# EAGLE design Flipdot_control (EAGLE 8.2.1)
Flip-dot Segment Controller

## Sheet 1 of 4: Connector and Row Drivers
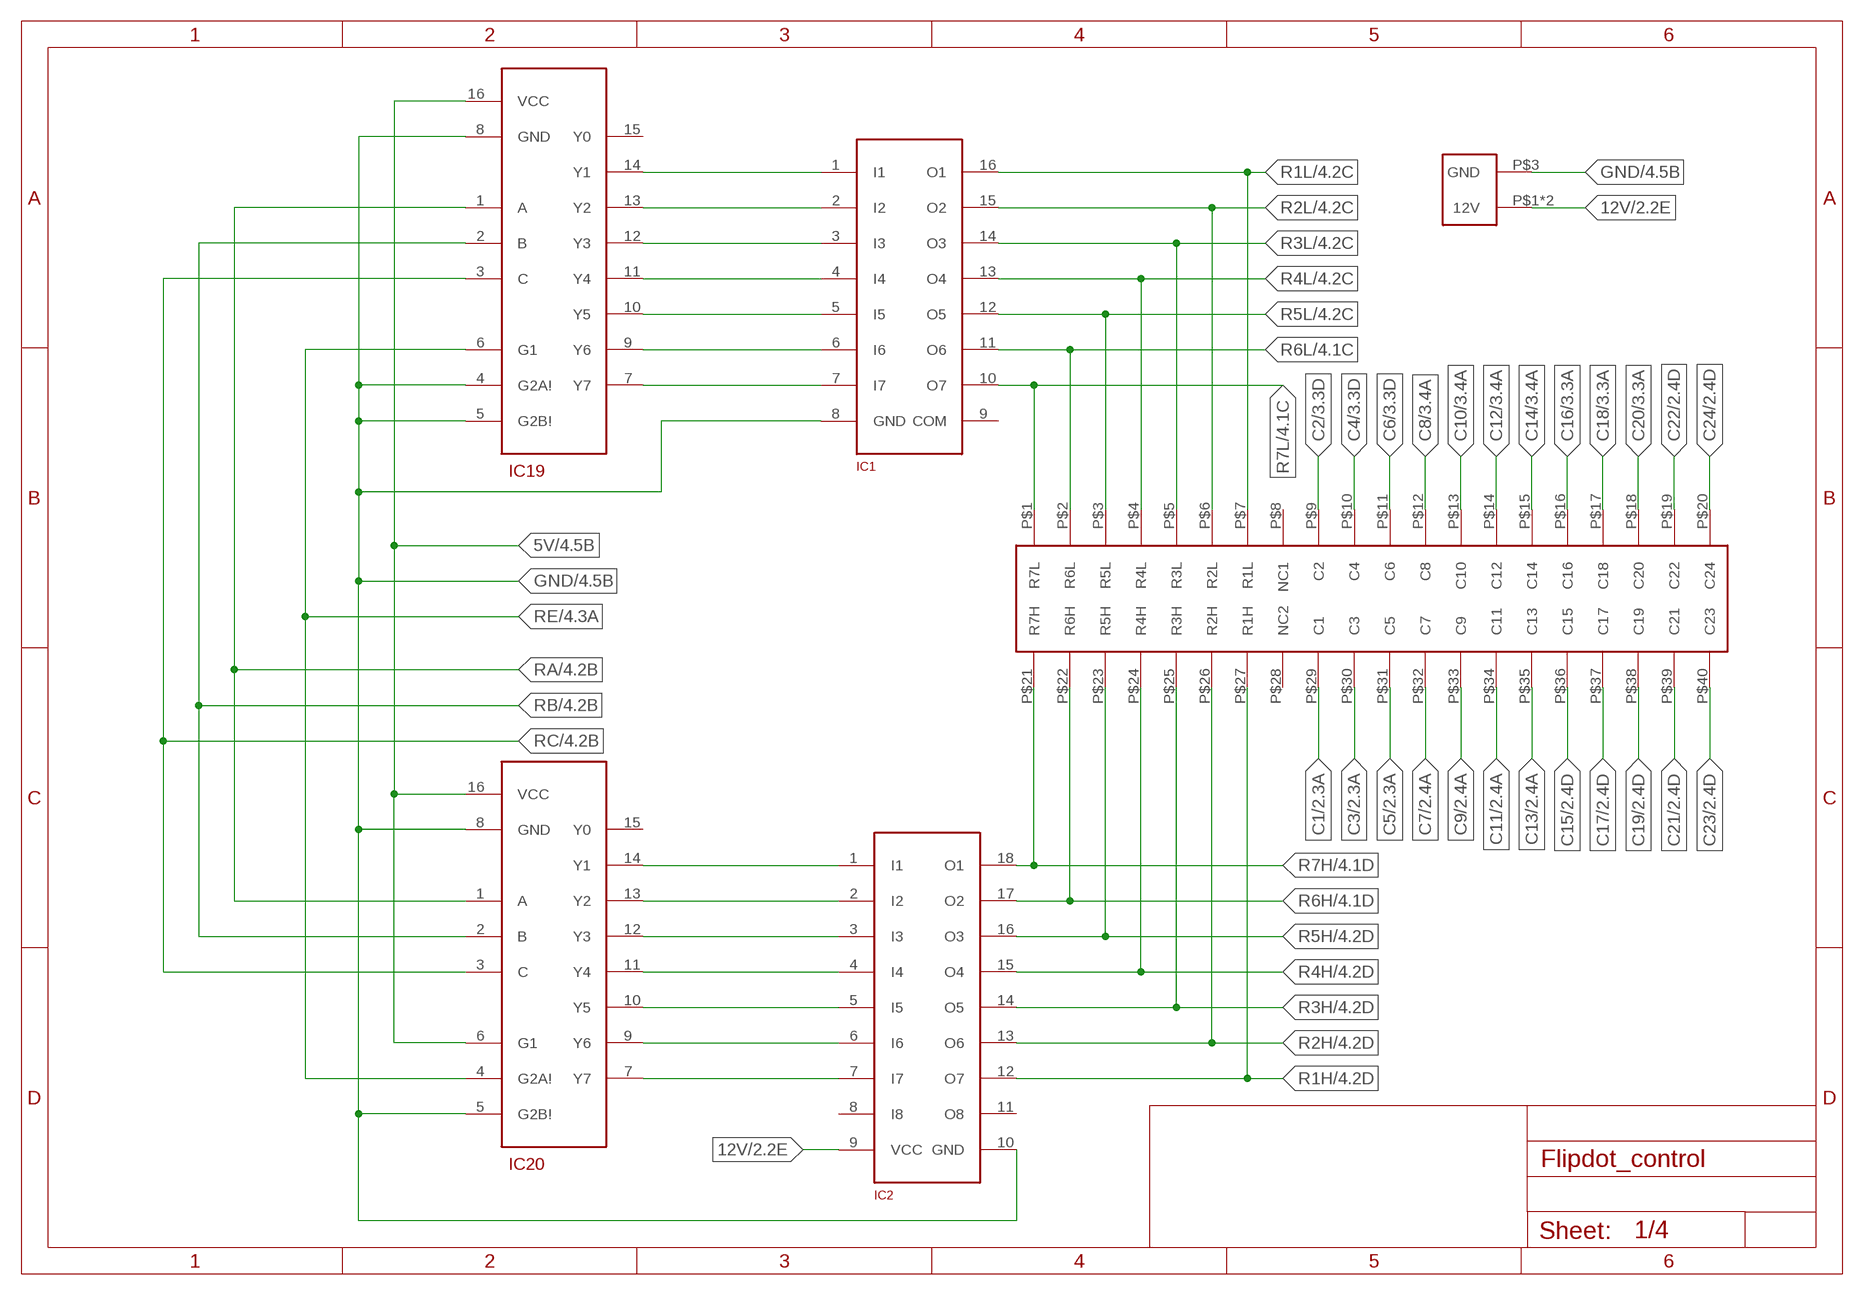
[diagram p0: schematic, sheet 1]

### Parts
IC1  ULN2003  [SO16]
IC2  TD62783_AFWG  [SO18W]
IC19  M74HC238  [SO16]
IC20  M74HC238  [SO16]
J1  HEADER_40  [HEADER_40]
U$1  PS  [PS]

### Nets
5V: IC19.16(VCC) IC20.6(G1) IC20.16(VCC) ; also sheet 2,3,4
12V: IC2.9(VCC) U$1.P$1(12V) U$1.P$2(12V) ; also sheet 2,3,4
C1: J1.P$29(C1) ; also sheet 2
C2: J1.P$9(C2) ; also sheet 3
C3: J1.P$30(C3) ; also sheet 2
C4: J1.P$10(C4) ; also sheet 3
C5: J1.P$31(C5) ; also sheet 2
C6: J1.P$11(C6) ; also sheet 3
C7: J1.P$32(C7) ; also sheet 2
C8: J1.P$12(C8) ; also sheet 3
C9: J1.P$33(C9) ; also sheet 2
C10: J1.P$13(C10) ; also sheet 3
C11: J1.P$34(C11) ; also sheet 2
C12: J1.P$14(C12) ; also sheet 3
C13: J1.P$35(C13) ; also sheet 2
C14: J1.P$15(C14) ; also sheet 3
C15: J1.P$36(C15) ; also sheet 2
C16: J1.P$16(C16) ; also sheet 3
C17: J1.P$37(C17) ; also sheet 2
C18: J1.P$17(C18) ; also sheet 3
C19: J1.P$38(C19) ; also sheet 2
C20: J1.P$18(C20) ; also sheet 3
C21: J1.P$39(C21) ; also sheet 2
C22: J1.P$19(C22) ; also sheet 2
C23: J1.P$40(C23) ; also sheet 2
C24: J1.P$20(C24) ; also sheet 2
GND: IC1.8(GND) IC2.10(GND) IC19.4(G2A!) IC19.5(G2B!) IC19.8(GND) IC20.5(G2B!) IC20.8(GND) U$1.P$3(GND) ; also sheet 2,3,4
N$15: IC1.1(I1) IC19.14(Y1)
N$16: IC1.2(I2) IC19.13(Y2)
N$17: IC1.3(I3) IC19.12(Y3)
N$18: IC1.4(I4) IC19.11(Y4)
N$19: IC1.5(I5) IC19.10(Y5)
N$20: IC1.6(I6) IC19.9(Y6)
N$21: IC1.7(I7) IC19.7(Y7)
N$24: IC2.1(I1) IC20.14(Y1)
N$25: IC2.2(I2) IC20.13(Y2)
N$26: IC2.3(I3) IC20.12(Y3)
N$27: IC2.4(I4) IC20.11(Y4)
N$28: IC2.5(I5) IC20.10(Y5)
N$29: IC2.6(I6) IC20.9(Y6)
N$30: IC2.7(I7) IC20.7(Y7)
R1H: IC2.12(O7) J1.P$27(R1H) ; also sheet 4
R1L: IC1.16(O1) J1.P$7(R1L) ; also sheet 4
R2H: IC2.13(O6) J1.P$26(R2H) ; also sheet 4
R2L: IC1.15(O2) J1.P$6(R2L) ; also sheet 4
R3H: IC2.14(O5) J1.P$25(R3H) ; also sheet 4
R3L: IC1.14(O3) J1.P$5(R3L) ; also sheet 4
R4H: IC2.15(O4) J1.P$24(R4H) ; also sheet 4
R4L: IC1.13(O4) J1.P$4(R4L) ; also sheet 4
R5H: IC2.16(O3) J1.P$23(R5H) ; also sheet 4
R5L: IC1.12(O5) J1.P$3(R5L) ; also sheet 4
R6H: IC2.17(O2) J1.P$22(R6H) ; also sheet 4
R6L: IC1.11(O6) J1.P$2(R6L) ; also sheet 4
R7H: IC2.18(O1) J1.P$21(R7H) ; also sheet 4
R7L: IC1.10(O7) J1.P$1(R7L) ; also sheet 4
RA: IC19.1(A) IC20.1(A) ; also sheet 4
RB: IC19.2(B) IC20.2(B) ; also sheet 4
RC: IC19.3(C) IC20.3(C) ; also sheet 4
RE: IC19.6(G1) IC20.4(G2A!) ; also sheet 4
Unconnected: IC1.9(COM) IC2.8(I8) IC2.11(O8) IC19.15(Y0) IC20.15(Y0) J1.P$8(NC1) J1.P$28(NC2)

## Sheet 2 of 4: Demultiplexers 1-4
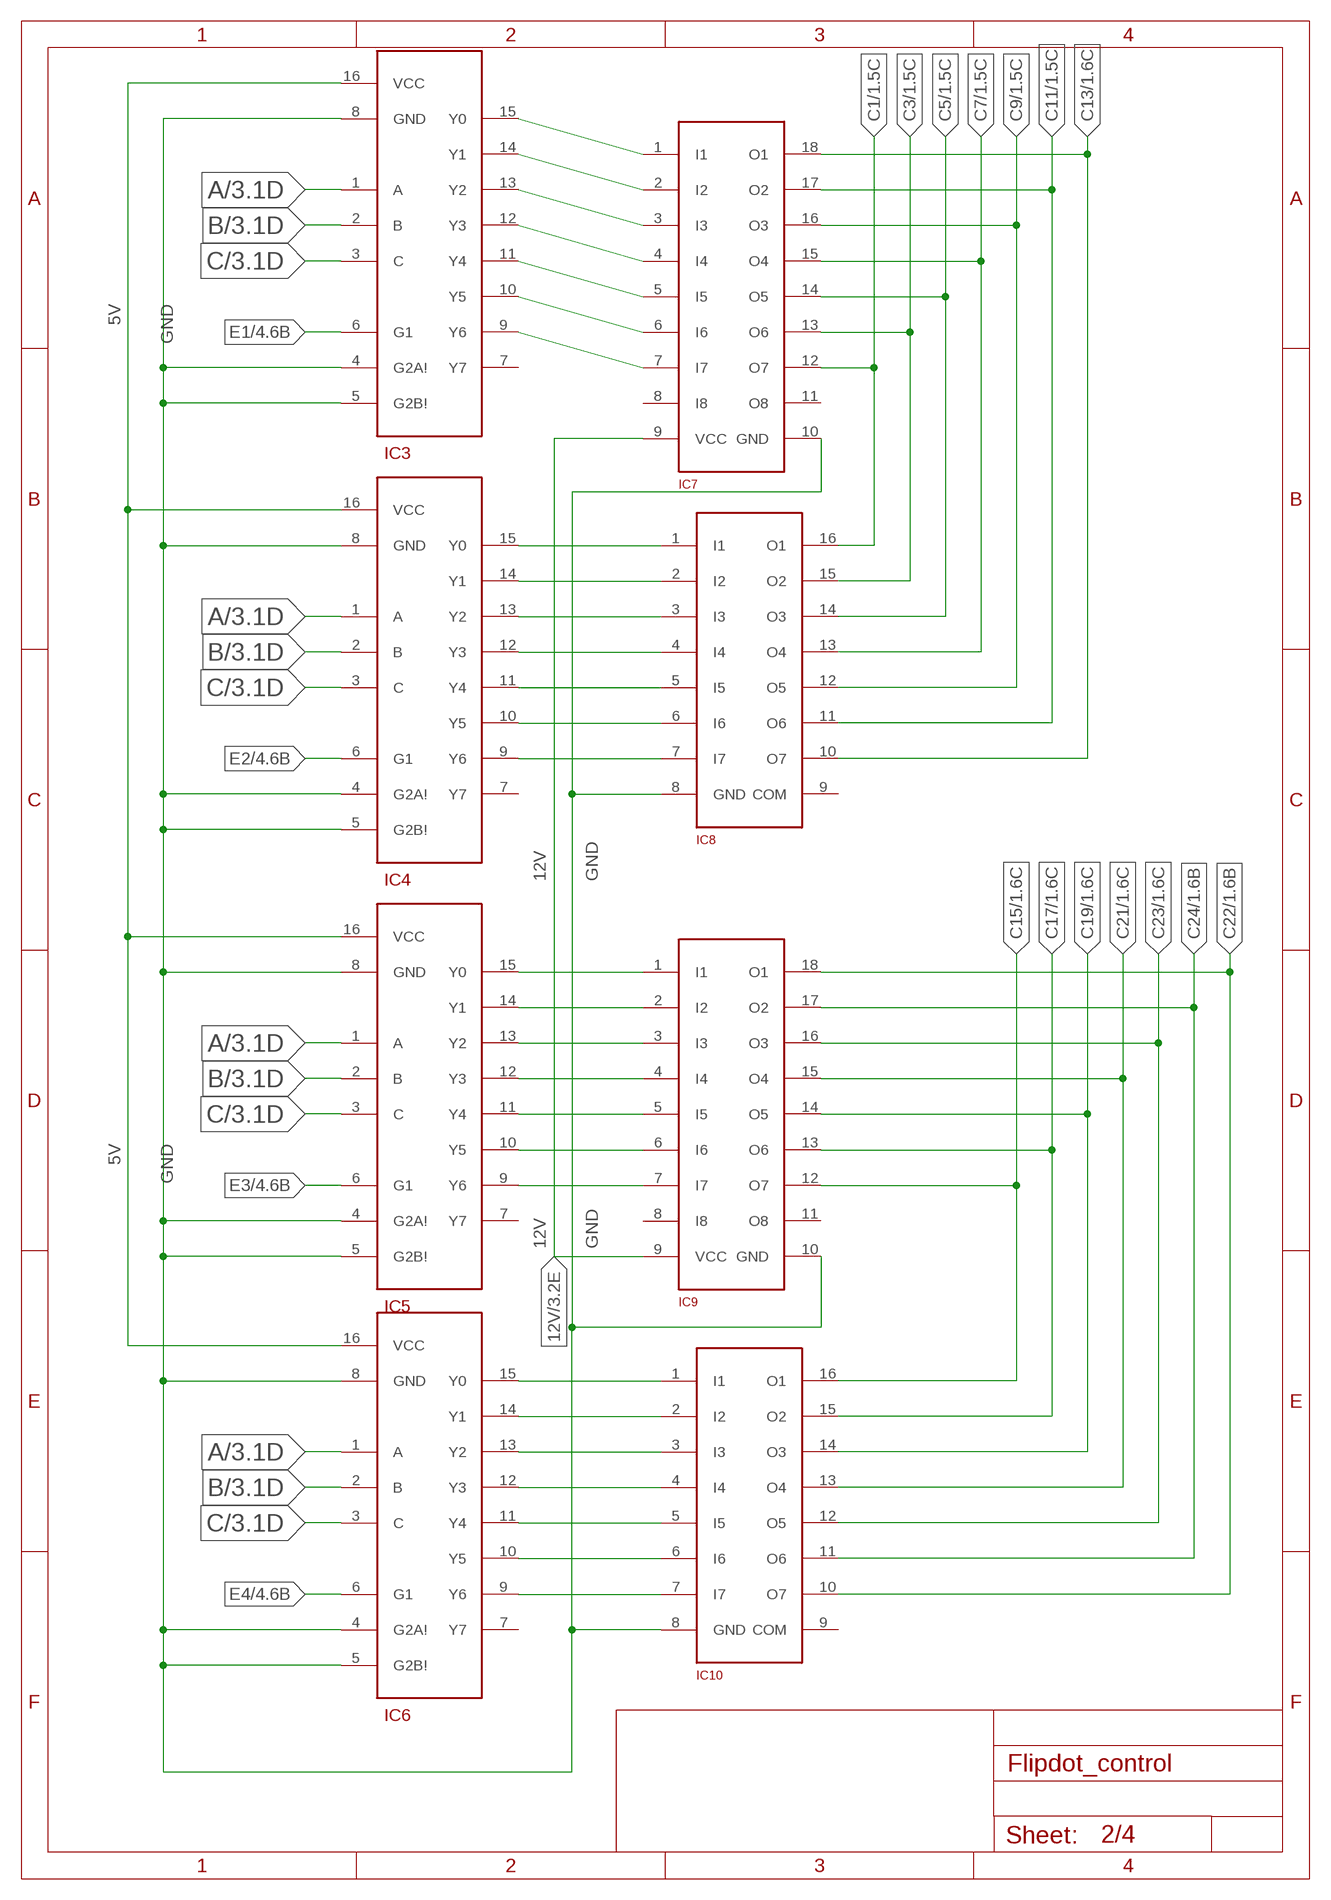
[diagram p1: schematic, sheet 2]

### Parts
IC3  M74HC238  [SO16]
IC4  M74HC238  [SO16]
IC5  M74HC238  [SO16]
IC6  M74HC238  [SO16]
IC7  TD62783_AFWG  [SO18W]
IC8  ULN2003  [SO16]
IC9  TD62783_AFWG  [SO18W]
IC10  ULN2003  [SO16]

### Nets
5V: IC3.16(VCC) IC4.16(VCC) IC5.16(VCC) IC6.16(VCC) ; also sheet 1,3,4
12V: IC7.9(VCC) IC9.9(VCC) ; also sheet 1,3,4
A: IC3.1(A) IC4.1(A) IC5.1(A) IC6.1(A) ; also sheet 3,4
B: IC3.2(B) IC4.2(B) IC5.2(B) IC6.2(B) ; also sheet 3,4
C: IC3.3(C) IC4.3(C) IC5.3(C) IC6.3(C) ; also sheet 3,4
C1: IC7.12(O7) IC8.16(O1) ; also sheet 1
C3: IC7.13(O6) IC8.15(O2) ; also sheet 1
C5: IC7.14(O5) IC8.14(O3) ; also sheet 1
C7: IC7.15(O4) IC8.13(O4) ; also sheet 1
C9: IC7.16(O3) IC8.12(O5) ; also sheet 1
C11: IC7.17(O2) IC8.11(O6) ; also sheet 1
C13: IC7.18(O1) IC8.10(O7) ; also sheet 1
C15: IC9.12(O7) IC10.16(O1) ; also sheet 1
C17: IC9.13(O6) IC10.15(O2) ; also sheet 1
C19: IC9.14(O5) IC10.14(O3) ; also sheet 1
C21: IC9.15(O4) IC10.13(O4) ; also sheet 1
C22: IC9.18(O1) IC10.10(O7) ; also sheet 1
C23: IC9.16(O3) IC10.12(O5) ; also sheet 1
C24: IC9.17(O2) IC10.11(O6) ; also sheet 1
E1: IC3.6(G1) ; also sheet 4
E2: IC4.6(G1) ; also sheet 4
E3: IC5.6(G1) ; also sheet 4
E4: IC6.6(G1) ; also sheet 4
GND: IC3.4(G2A!) IC3.5(G2B!) IC3.8(GND) IC4.4(G2A!) IC4.5(G2B!) IC4.8(GND) IC5.4(G2A!) IC5.5(G2B!) IC5.8(GND) IC6.4(G2A!) IC6.5(G2B!) IC6.8(GND) IC7.10(GND) IC8.8(GND) IC9.10(GND) IC10.8(GND) ; also sheet 1,3,4
N$83: IC3.15(Y0) IC7.1(I1)
N$84: IC3.14(Y1) IC7.2(I2)
N$85: IC3.13(Y2) IC7.3(I3)
N$86: IC3.12(Y3) IC7.4(I4)
N$87: IC3.11(Y4) IC7.5(I5)
N$88: IC3.10(Y5) IC7.6(I6)
N$89: IC3.9(Y6) IC7.7(I7)
N$90: IC4.15(Y0) IC8.1(I1)
N$91: IC4.14(Y1) IC8.2(I2)
N$92: IC4.13(Y2) IC8.3(I3)
N$93: IC4.12(Y3) IC8.4(I4)
N$94: IC4.11(Y4) IC8.5(I5)
N$95: IC4.10(Y5) IC8.6(I6)
N$96: IC4.9(Y6) IC8.7(I7)
N$97: IC5.15(Y0) IC9.1(I1)
N$98: IC5.14(Y1) IC9.2(I2)
N$99: IC5.13(Y2) IC9.3(I3)
N$100: IC5.12(Y3) IC9.4(I4)
N$101: IC5.11(Y4) IC9.5(I5)
N$102: IC5.10(Y5) IC9.6(I6)
N$103: IC5.9(Y6) IC9.7(I7)
N$104: IC6.15(Y0) IC10.1(I1)
N$105: IC6.14(Y1) IC10.2(I2)
N$106: IC6.13(Y2) IC10.3(I3)
N$107: IC6.12(Y3) IC10.4(I4)
N$108: IC6.11(Y4) IC10.5(I5)
N$109: IC6.10(Y5) IC10.6(I6)
N$110: IC6.9(Y6) IC10.7(I7)
Unconnected: IC3.7(Y7) IC4.7(Y7) IC5.7(Y7) IC6.7(Y7) IC7.8(I8) IC7.11(O8) IC8.9(COM) IC9.8(I8) IC9.11(O8) IC10.9(COM)

## Sheet 3 of 4: Demultiplexers 5-7
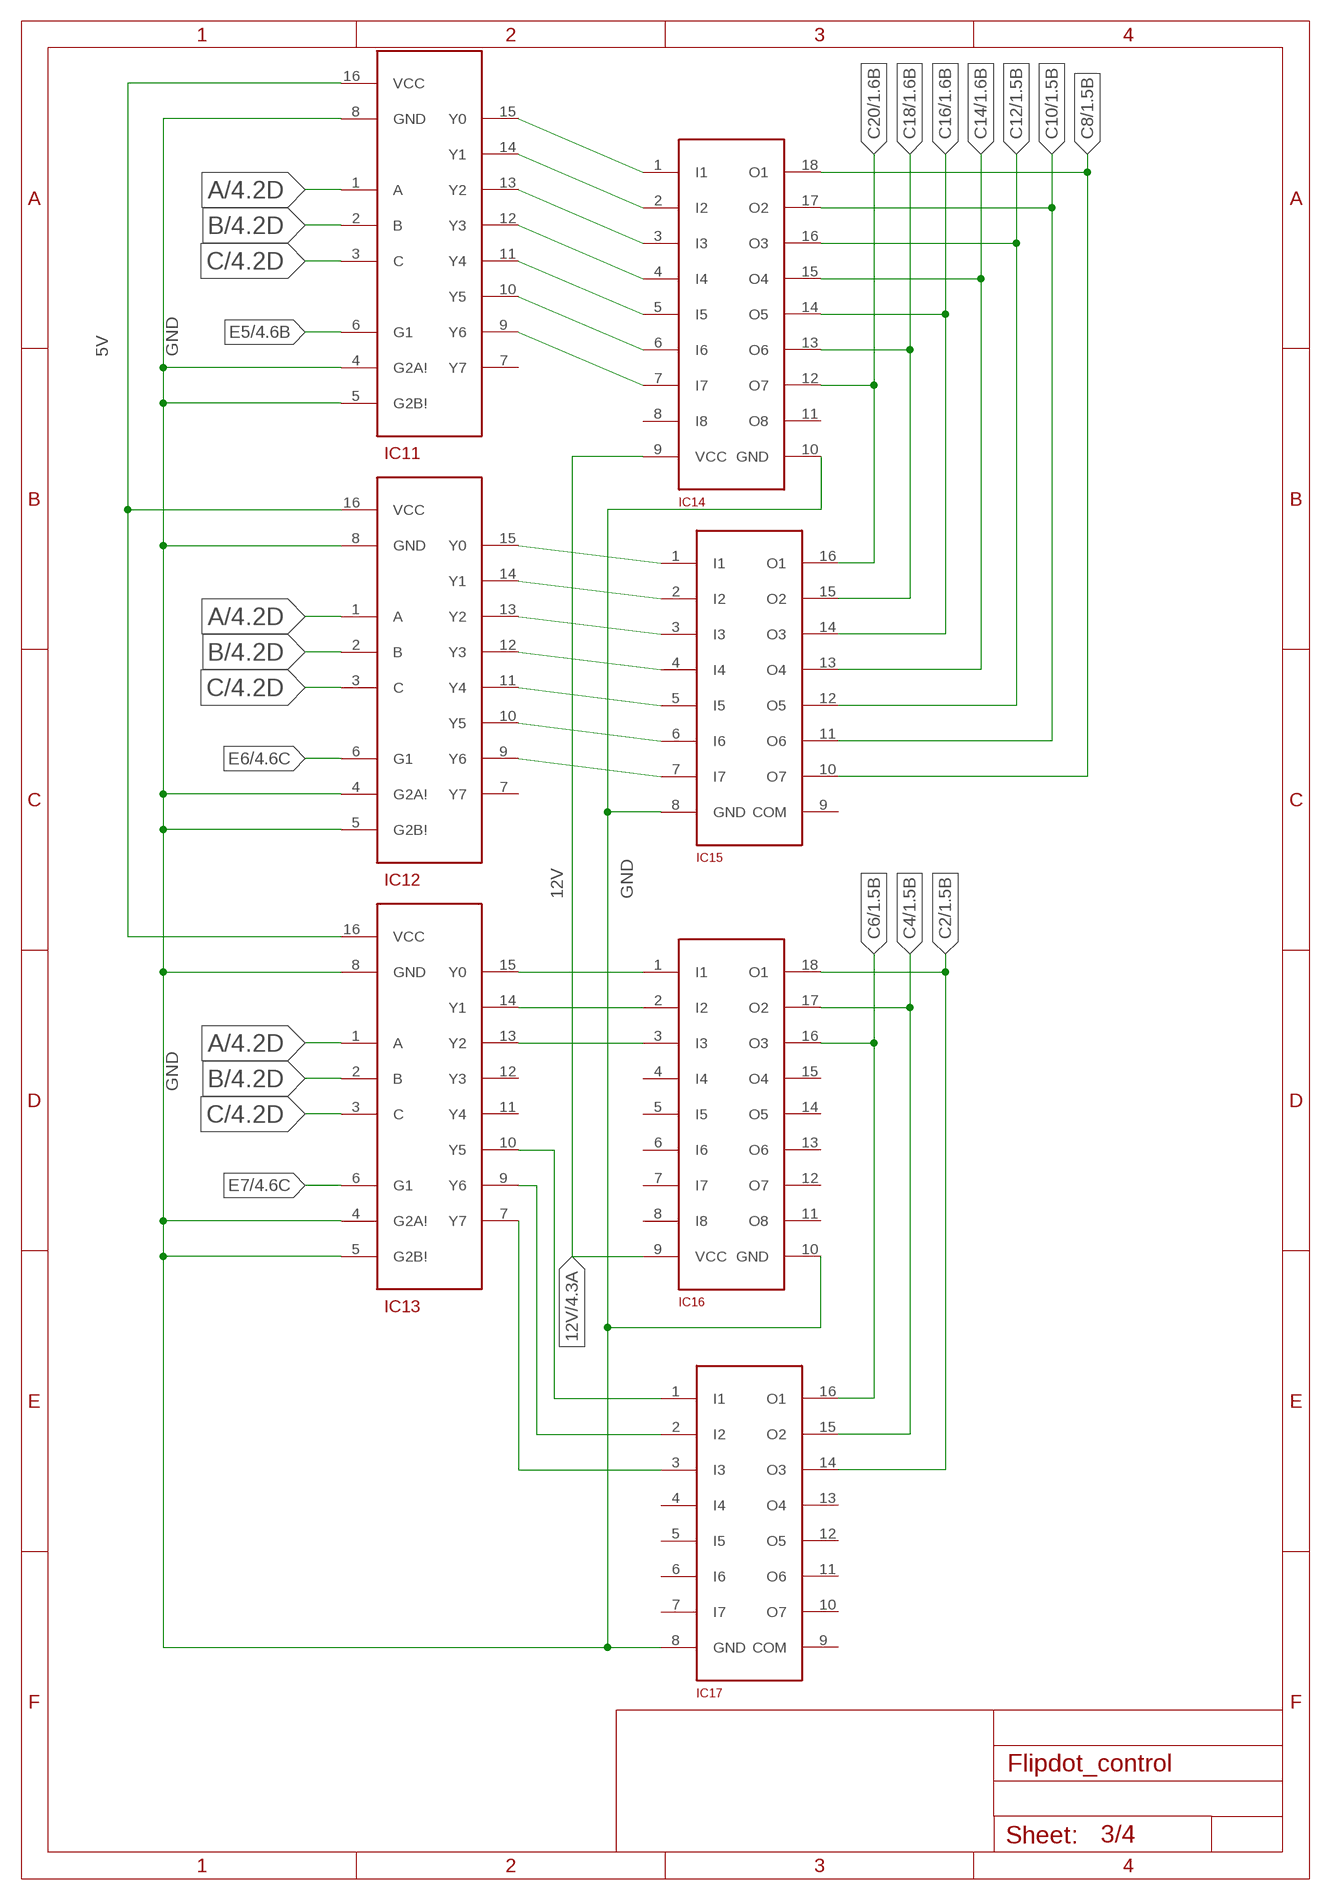
[diagram p2: schematic, sheet 3]

### Parts
IC11  M74HC238  [SO16]
IC12  M74HC238  [SO16]
IC13  M74HC238  [SO16]
IC14  TD62783_AFWG  [SO18W]
IC15  ULN2003  [SO16]
IC16  TD62783_AFWG  [SO18W]
IC17  ULN2003  [SO16]

### Nets
5V: IC11.16(VCC) IC12.16(VCC) IC13.16(VCC) ; also sheet 1,2,4
12V: IC14.9(VCC) IC16.9(VCC) ; also sheet 1,2,4
A: IC11.1(A) IC12.1(A) IC13.1(A) ; also sheet 2,4
B: IC11.2(B) IC12.2(B) IC13.2(B) ; also sheet 2,4
C: IC11.3(C) IC12.3(C) IC13.3(C) ; also sheet 2,4
C2: IC16.18(O1) IC17.14(O3) ; also sheet 1
C4: IC16.17(O2) IC17.15(O2) ; also sheet 1
C6: IC16.16(O3) IC17.16(O1) ; also sheet 1
C8: IC14.18(O1) IC15.10(O7) ; also sheet 1
C10: IC14.17(O2) IC15.11(O6) ; also sheet 1
C12: IC14.16(O3) IC15.12(O5) ; also sheet 1
C14: IC14.15(O4) IC15.13(O4) ; also sheet 1
C16: IC14.14(O5) IC15.14(O3) ; also sheet 1
C18: IC14.13(O6) IC15.15(O2) ; also sheet 1
C20: IC14.12(O7) IC15.16(O1) ; also sheet 1
E5: IC11.6(G1) ; also sheet 4
E6: IC12.6(G1) ; also sheet 4
E7: IC13.6(G1) ; also sheet 4
GND: IC11.4(G2A!) IC11.5(G2B!) IC11.8(GND) IC12.4(G2A!) IC12.5(G2B!) IC12.8(GND) IC13.4(G2A!) IC13.5(G2B!) IC13.8(GND) IC14.10(GND) IC15.8(GND) IC16.10(GND) IC17.8(GND) ; also sheet 1,2,4
N$63: IC11.15(Y0) IC14.1(I1)
N$64: IC11.14(Y1) IC14.2(I2)
N$65: IC11.13(Y2) IC14.3(I3)
N$66: IC11.12(Y3) IC14.4(I4)
N$67: IC11.11(Y4) IC14.5(I5)
N$68: IC11.10(Y5) IC14.6(I6)
N$69: IC11.9(Y6) IC14.7(I7)
N$70: IC12.15(Y0) IC15.1(I1)
N$71: IC12.14(Y1) IC15.2(I2)
N$72: IC12.13(Y2) IC15.3(I3)
N$73: IC12.12(Y3) IC15.4(I4)
N$74: IC12.11(Y4) IC15.5(I5)
N$75: IC12.10(Y5) IC15.6(I6)
N$76: IC12.9(Y6) IC15.7(I7)
N$77: IC13.15(Y0) IC16.1(I1)
N$78: IC13.14(Y1) IC16.2(I2)
N$79: IC13.13(Y2) IC16.3(I3)
N$80: IC13.10(Y5) IC17.1(I1)
N$81: IC13.9(Y6) IC17.2(I2)
N$82: IC13.7(Y7) IC17.3(I3)
Unconnected: IC11.7(Y7) IC12.7(Y7) IC13.11(Y4) IC13.12(Y3) IC14.8(I8) IC14.11(O8) IC15.9(COM) IC16.4(I4) IC16.5(I5) IC16.6(I6) IC16.7(I7) IC16.8(I8) IC16.11(O8) IC16.12(O7) IC16.13(O6) IC16.14(O5) IC16.15(O4) IC17.4(I4) IC17.5(I5) IC17.6(I6) IC17.7(I7) IC17.9(COM) IC17.10(O7) IC17.11(O6) IC17.12(O5) IC17.13(O4)

## Sheet 4 of 4: Pre-Demultiplexer
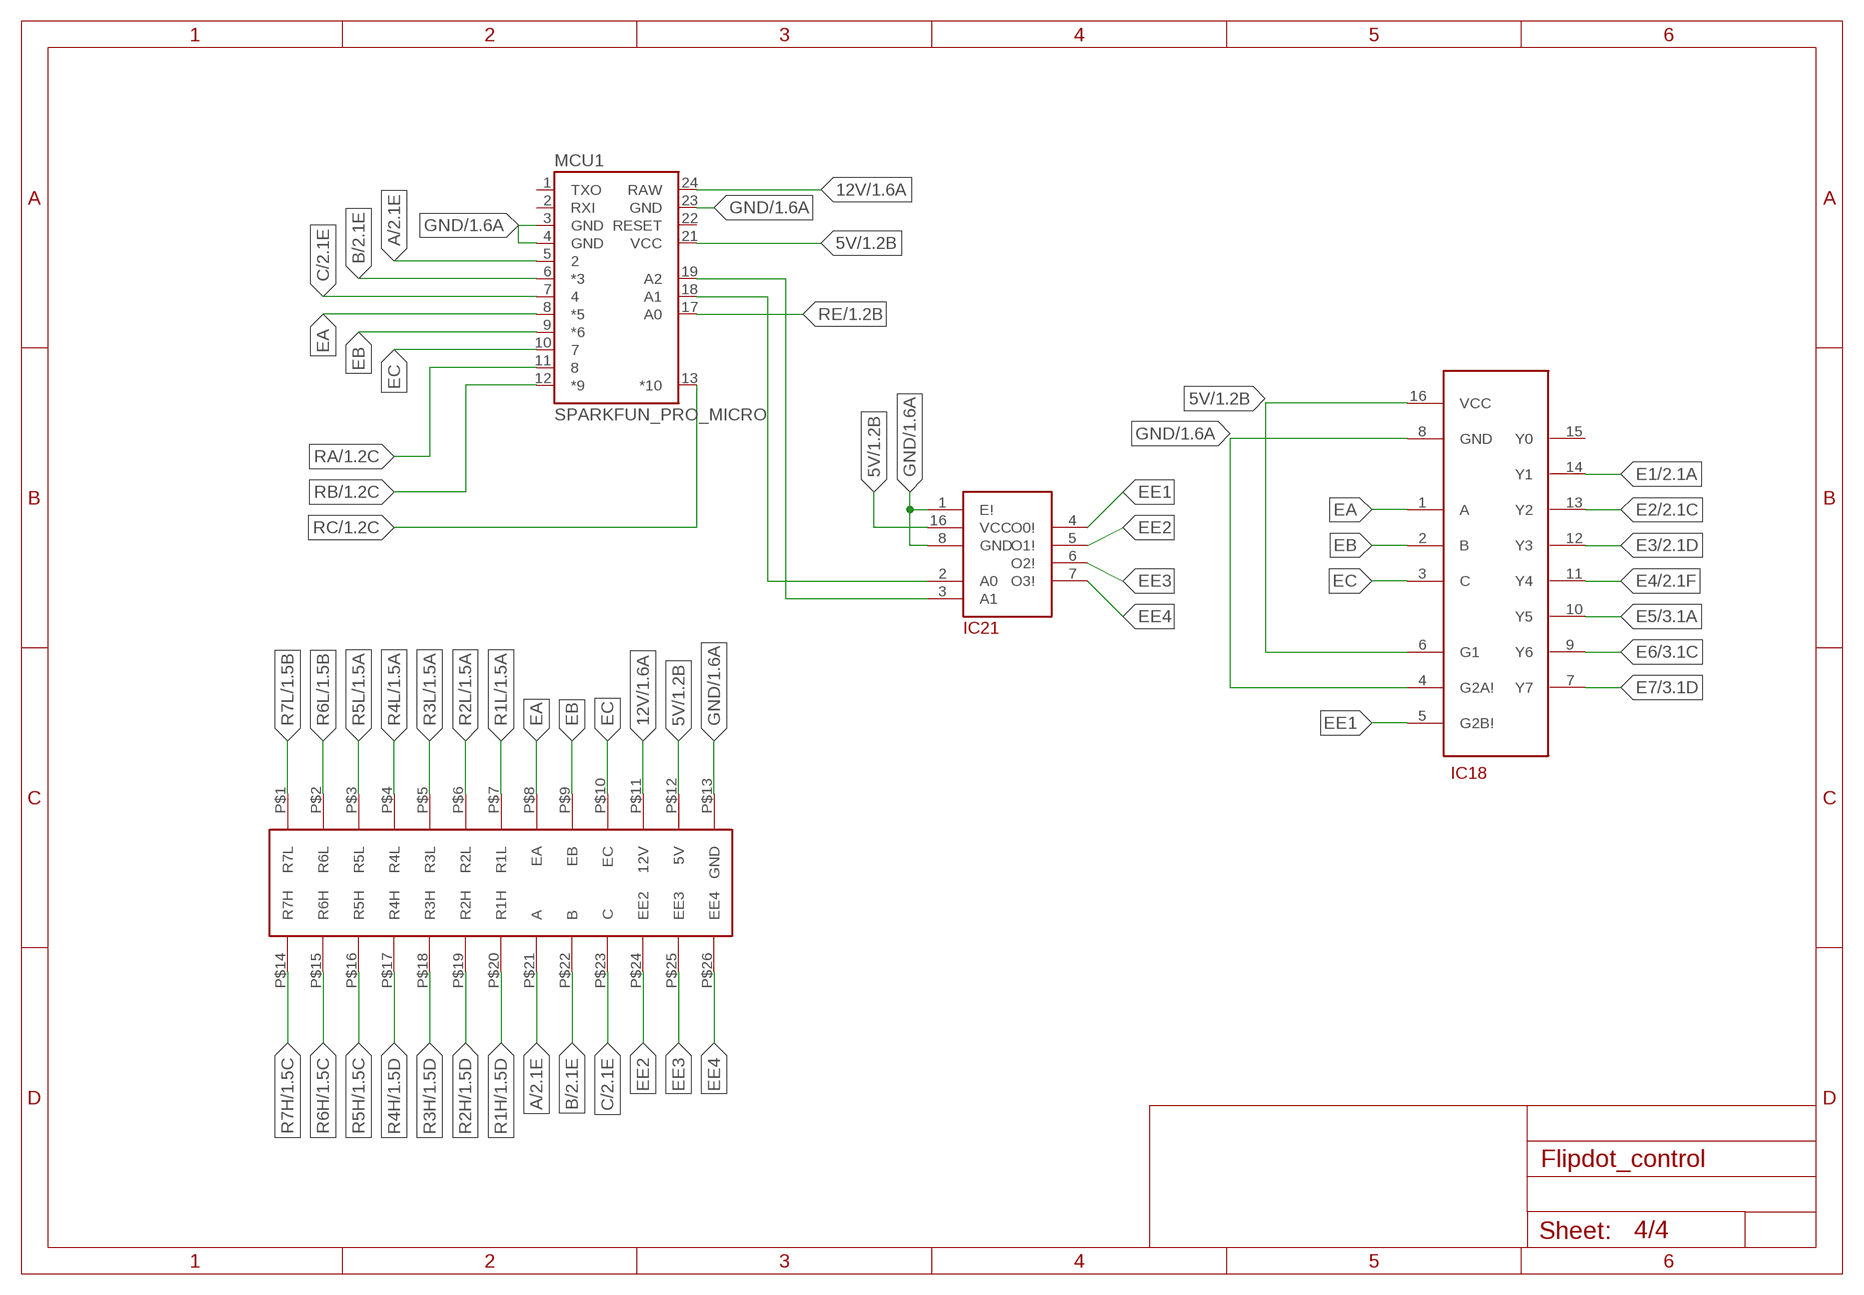
[diagram p3: schematic, sheet 4]

### Parts
IC18  M74HC238  [SO16]
IC21  74AC139SC  [SO16]
J2  HEADER_26  [HEADER_26]
MCU1  SPARKFUN_PRO_MICRO  [SPARKFUN_PRO_MICRO]

### Nets
5V: IC18.6(G1) IC18.16(VCC) IC21.16(VCC) J2.P$12(5V) MCU1.21(VCC) ; also sheet 1,2,3
12V: J2.P$11(12V) MCU1.24(RAW) ; also sheet 1,2,3
A: J2.P$21(A) MCU1.5 ; also sheet 2,3
B: J2.P$22(B) MCU1.6(*3) ; also sheet 2,3
C: J2.P$23(C) MCU1.7 ; also sheet 2,3
E1: IC18.14(Y1) ; also sheet 2
E2: IC18.13(Y2) ; also sheet 2
E3: IC18.12(Y3) ; also sheet 2
E4: IC18.11(Y4) ; also sheet 2
E5: IC18.10(Y5) ; also sheet 3
E6: IC18.9(Y6) ; also sheet 3
E7: IC18.7(Y7) ; also sheet 3
EA: IC18.1(A) J2.P$8(EA) MCU1.8(*5)
EB: IC18.2(B) J2.P$9(EB) MCU1.9(*6)
EC: IC18.3(C) J2.P$10(EC) MCU1.10
EE1: IC18.5(G2B!) IC21.4(O0!)
EE2: IC21.5(O1!) J2.P$24(EE2)
EE3: IC21.6(O2!) J2.P$25(EE3)
EE4: IC21.7(O3!) J2.P$26(EE4)
GND: IC18.4(G2A!) IC18.8(GND) IC21.1(E!) IC21.8(GND) J2.P$13(GND) MCU1.3(GND) MCU1.4(GND) MCU1.23(GND) ; also sheet 1,2,3
N$1: IC21.2(A0) MCU1.18(A1)
N$2: IC21.3(A1) MCU1.19(A2)
R1H: J2.P$20(R1H) ; also sheet 1
R1L: J2.P$7(R1L) ; also sheet 1
R2H: J2.P$19(R2H) ; also sheet 1
R2L: J2.P$6(R2L) ; also sheet 1
R3H: J2.P$18(R3H) ; also sheet 1
R3L: J2.P$5(R3L) ; also sheet 1
R4H: J2.P$17(R4H) ; also sheet 1
R4L: J2.P$4(R4L) ; also sheet 1
R5H: J2.P$16(R5H) ; also sheet 1
R5L: J2.P$3(R5L) ; also sheet 1
R6H: J2.P$15(R6H) ; also sheet 1
R6L: J2.P$2(R6L) ; also sheet 1
R7H: J2.P$14(R7H) ; also sheet 1
R7L: J2.P$1(R7L) ; also sheet 1
RA: MCU1.11 ; also sheet 1
RB: MCU1.12(*9) ; also sheet 1
RC: MCU1.13(*10) ; also sheet 1
RE: MCU1.17(A0) ; also sheet 1
Unconnected: IC18.15(Y0) MCU1.1(TXO) MCU1.2(RXI) MCU1.22(RESET)

## Library data of the parts
IC1 IC8 IC10 IC15 IC17 = Flipdot:ULN2003: Darlington Transistor [GND]
IC2 IC7 IC9 IC14 IC16 = Flipdot:TD62783_AFWG: Darlington Source Array [V]
IC3-IC6 IC11-IC13 IC18-IC20 = Flipdot:M74HC238: 3 To 8 Line Decoder
IC21 = Flipdot:74AC139SC: 2-4 Line Decoder
J1 = Flipdot:HEADER_40
J2 = Flipdot:HEADER_26
MCU1 = Flipdot:SPARKFUN_PRO_MICRO: SparkFun Pro Micro Atmega32U4 compatible footprint. SparkFun Products: 3.3V/8MHz <https://www.sparkfun.com/products/12587> 5V/16MHz <https://www.sparkfun.com/products/12640>
U$1 = Flipdot:PS

## Board
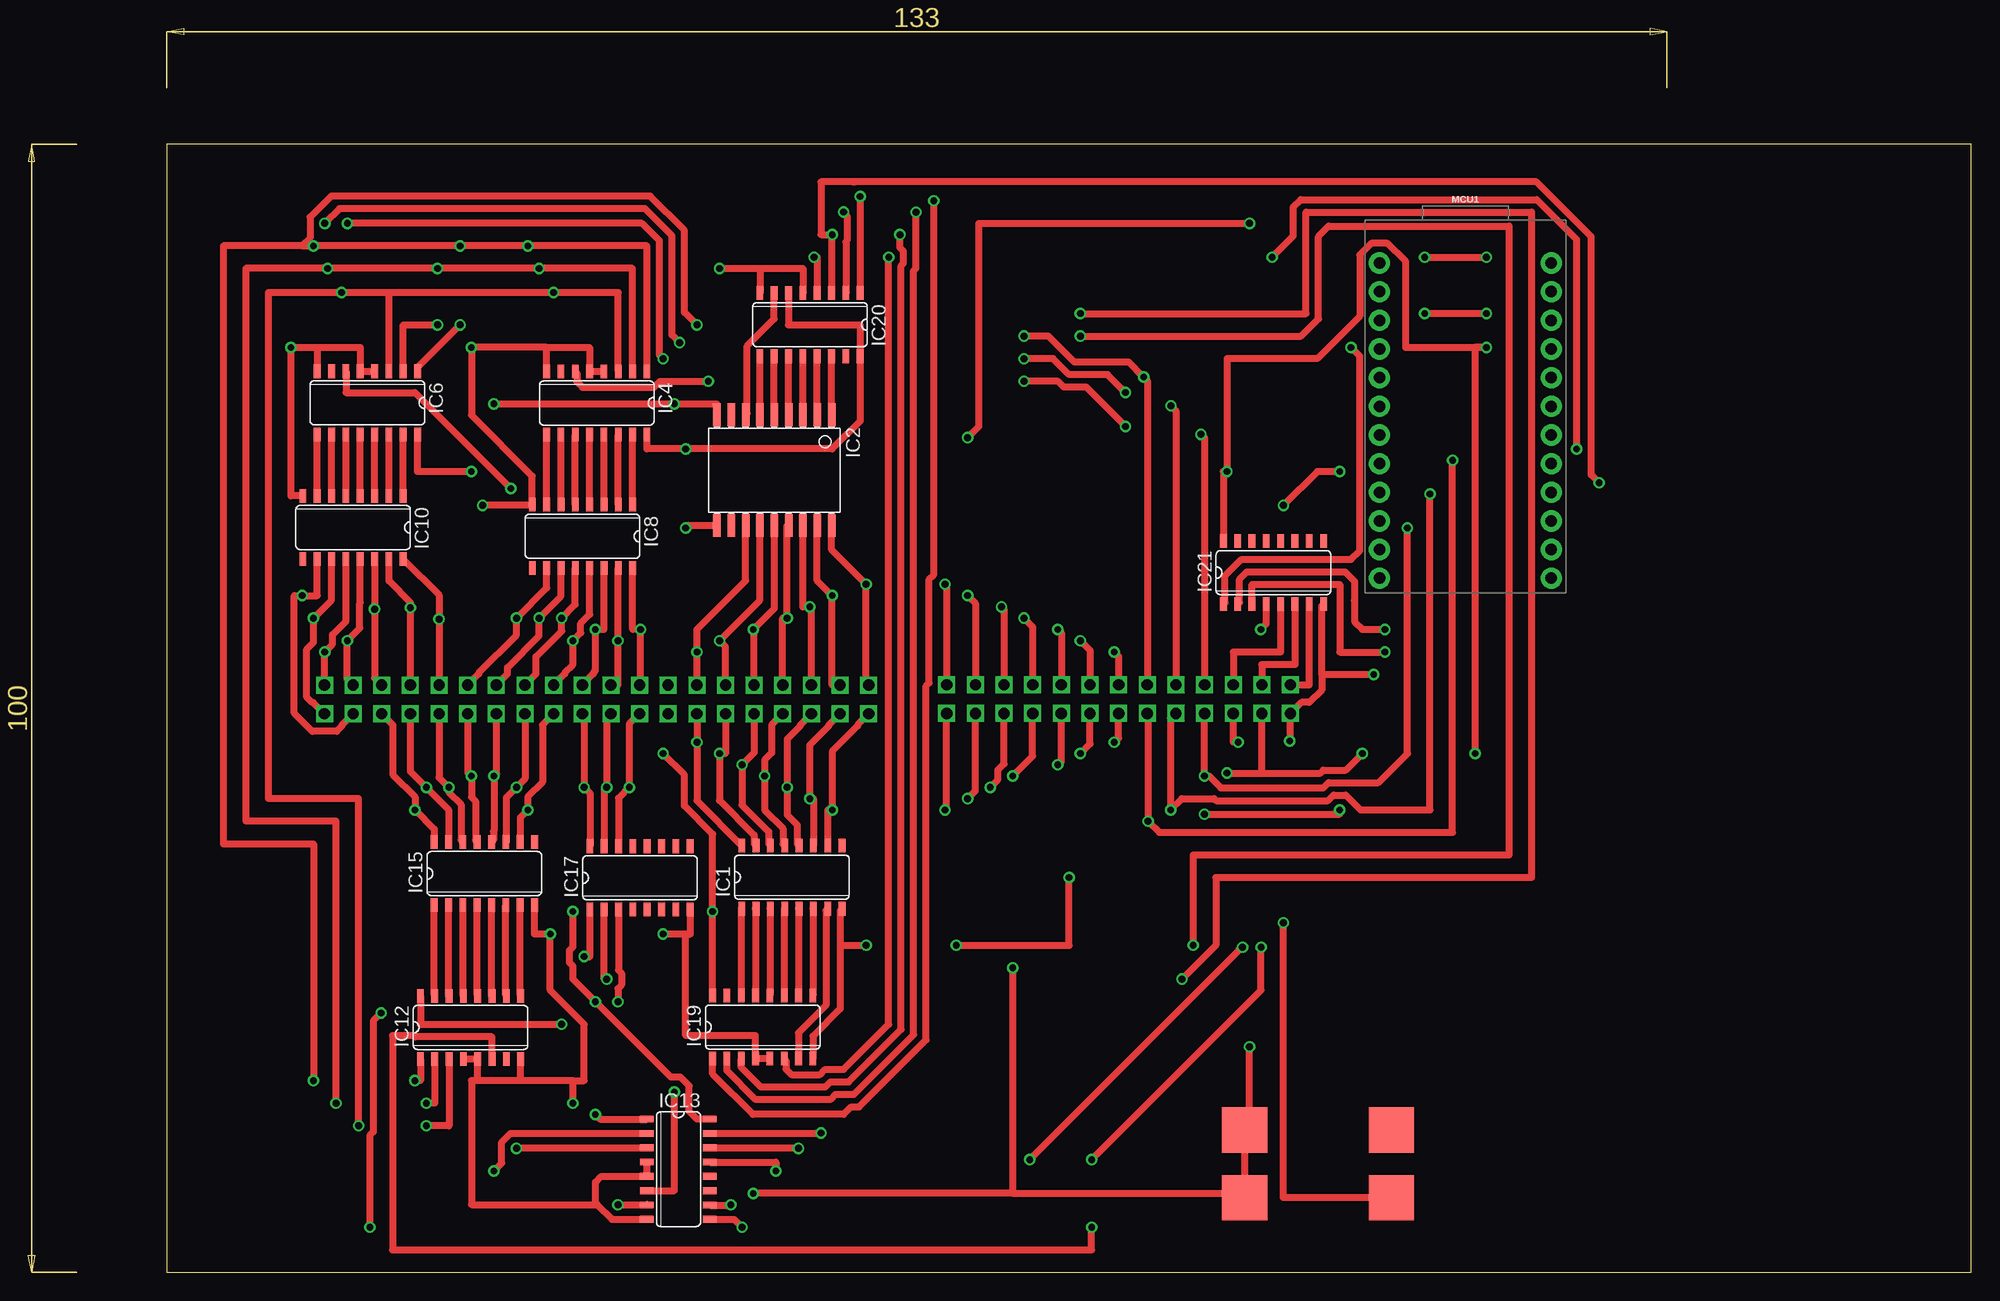
[diagram p4: board, top side]
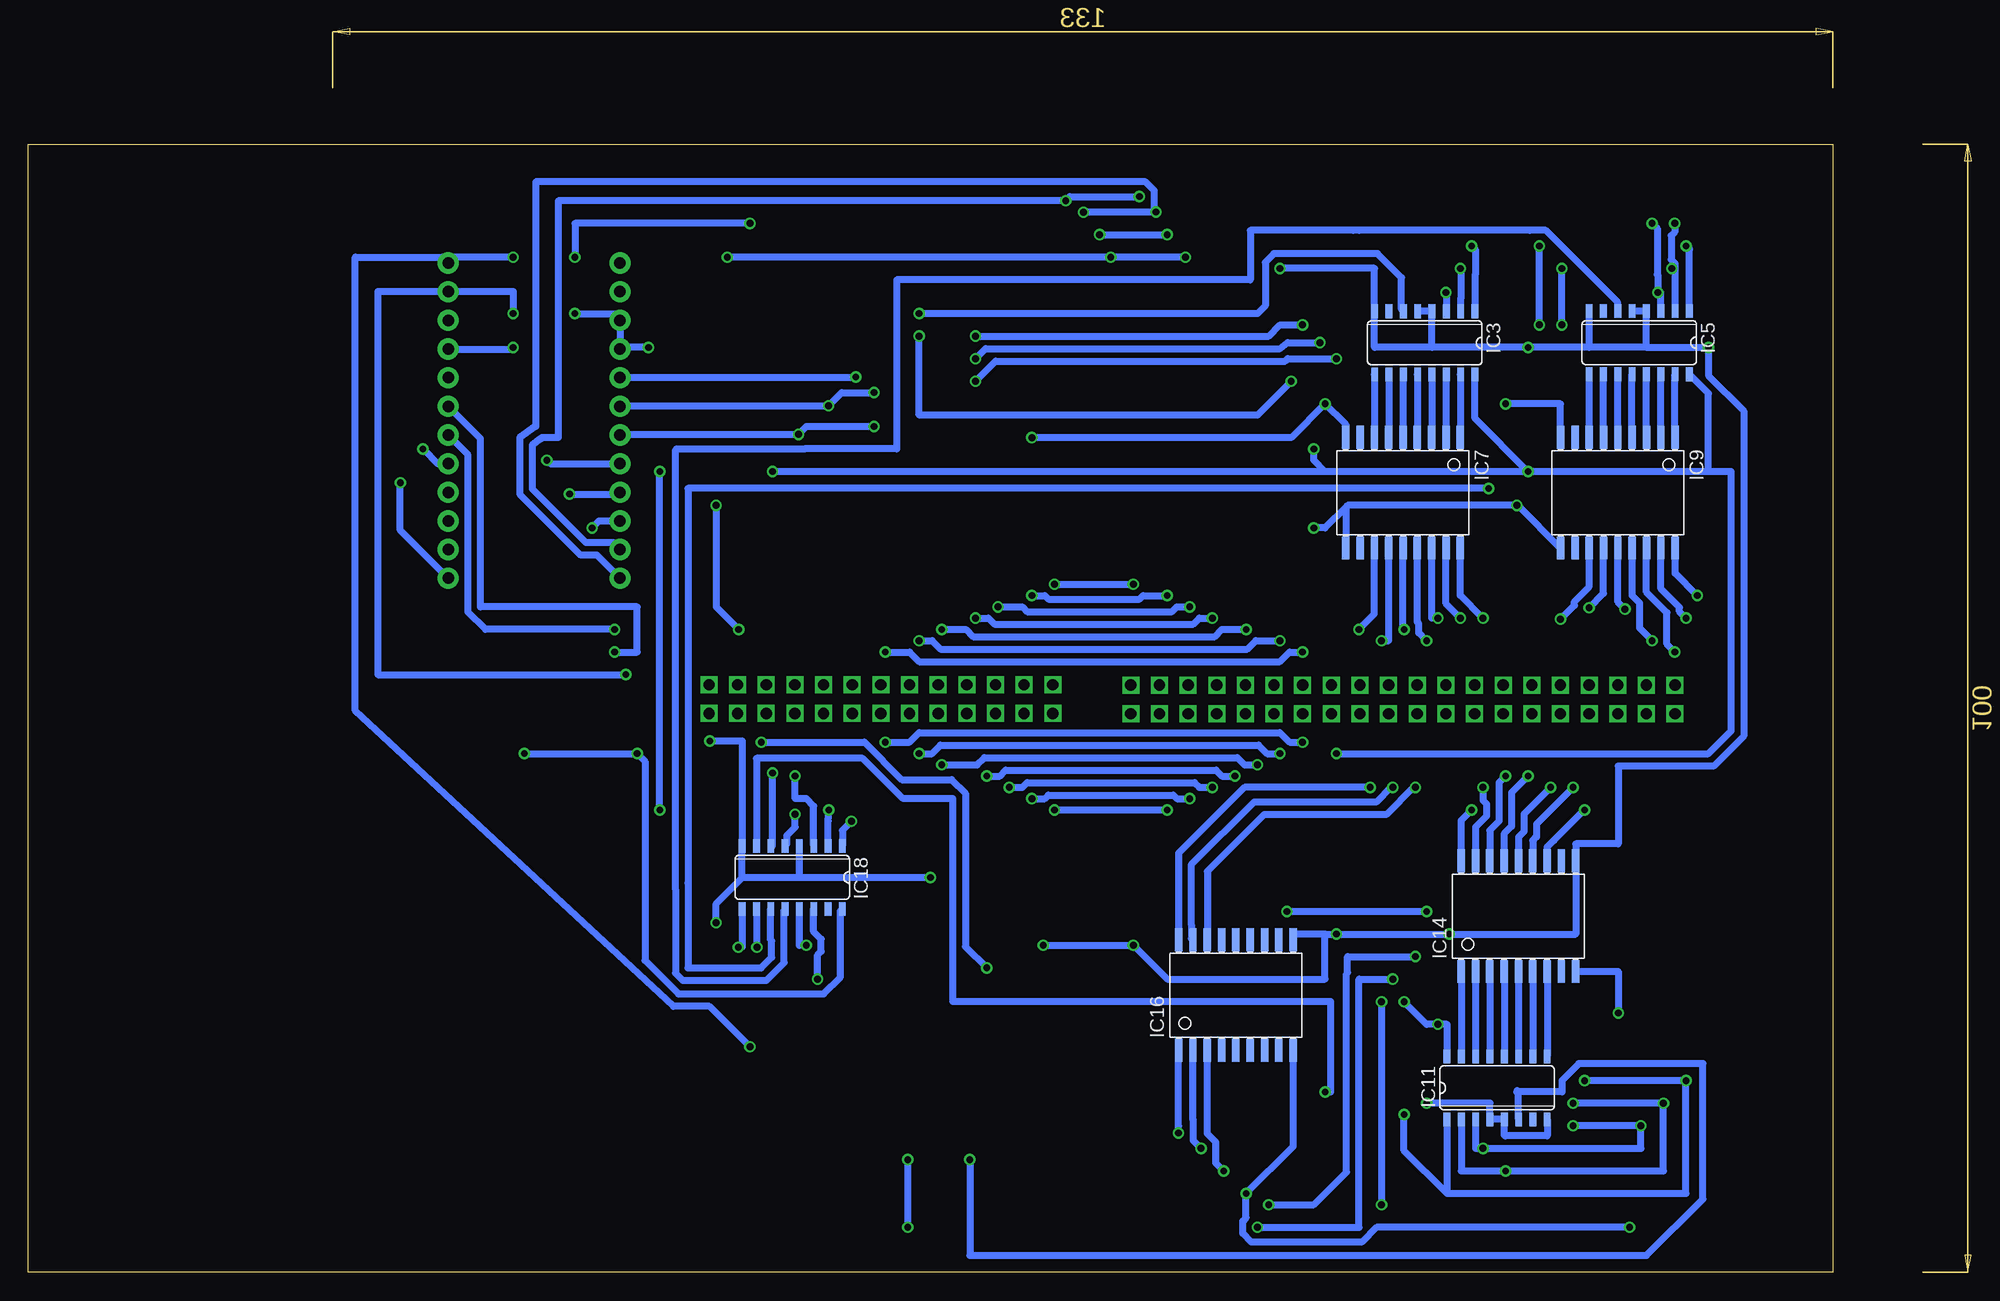
[diagram p5: board, bottom side, seen from below]

Size 160 x 100 mm. Coordinates in mm from the lower left corner, seen from the top.
Outline: 0,0 160,0 160,100 0,100 0,0
Copper layers (1*16): Top 0.035mm / dielectric 1.5mm / Bottom 0.035mm
Design rules "default *": minimum track width 0.6mm, minimum drill 0.6mm, track to track 0.5mm, track to pad 0.5mm, pad to pad 0.5mm, via to via 0.5mm, smd to smd 0.5mm, copper to edge 40mil, drill to drill 6mil, minimum pad ring 10mil, minimum via ring 8mil, stop-mask expansion 4mil, vias tented up to drill 0mil, thermal gap 10mil

### Footprints (pad centres in the part's own frame; a part is rotated, then mirrored left to right if it is on the bottom)
SO16 = smd 0.6 x 1.2: 1 -4.445,-2.8; 2 -3.175,-2.8; 3 -1.905,-2.8; 4 -0.635,-2.8; 5 0.635,-2.8; 6 1.905,-2.8; 7 3.175,-2.8; 8 4.445,-2.8; 9 4.445,2.8; 10 3.175,2.8; 11 1.905,2.8; 12 0.635,2.8; 13 -0.635,2.8; 14 -1.905,2.8; 15 -3.175,2.8; 16 -4.445,2.8
SO18W = smd 0.66 x 2.032: 1 -5.08,-4.902; 2 -3.81,-4.902; 3 -2.54,-4.902; 4 -1.27,-4.902; 5 0,-4.902; 6 1.27,-4.902; 7 2.54,-4.902; 8 3.81,-4.902; 9 5.08,-4.902; 10 5.08,4.902; 11 3.81,4.902; 12 2.54,4.902; 13 1.27,4.902; 14 0,4.902; 15 -1.27,4.902; 16 -2.54,4.902; 17 -3.81,4.902; 18 -5.08,4.902
HEADER_40 = drill 1 square: P$1 -22.86,0; P$2 -20.32,0; P$3 -17.78,0; P$4 -15.24,0; P$5 -12.7,0; P$6 -10.16,0; P$7 -7.62,0; P$8 -5.08,0; P$9 -2.54,0; P$10 0,0; P$11 2.54,0; P$12 5.08,0; P$13 7.62,0; P$14 10.16,0; P$15 12.7,0; P$16 15.24,0; P$17 17.78,0; P$18 20.32,0; P$19 22.86,0; P$20 25.4,0; P$21 -22.86,-2.54; P$22 -20.32,-2.54; P$23 -17.78,-2.54; P$24 -15.24,-2.54; P$25 -12.7,-2.54; P$26 -10.16,-2.54; P$27 -7.62,-2.54; P$28 -5.08,-2.54; P$29 -2.54,-2.54; P$30 0,-2.54; P$31 2.54,-2.54; P$32 5.08,-2.54; P$33 7.62,-2.54; P$34 10.16,-2.54; P$35 12.7,-2.54; P$36 15.24,-2.54; P$37 17.78,-2.54; P$38 20.32,-2.54; P$39 22.86,-2.54; P$40 25.4,-2.54
HEADER_26 = drill 1 square: P$1 -15.24,1.27; P$2 -12.7,1.27; P$3 -10.16,1.27; P$4 -7.62,1.27; P$5 -5.08,1.27; P$6 -2.54,1.27; P$7 0,1.27; P$8 2.54,1.27; P$9 5.08,1.27; P$10 7.62,1.27; P$11 10.16,1.27; P$12 12.7,1.27; P$13 15.24,1.27; P$14 -15.24,-1.27; P$15 -12.7,-1.27; P$16 -10.16,-1.27; P$17 -7.62,-1.27; P$18 -5.08,-1.27; P$19 -2.54,-1.27; P$20 0,-1.27; P$21 2.54,-1.27; P$22 5.08,-1.27; P$23 7.62,-1.27; P$24 10.16,-1.27; P$25 12.7,-1.27; P$26 15.24,-1.27
SPARKFUN_PRO_MICRO = drill 1.016 pad 1.88: 1 -7.62,12.7; 2 -7.62,10.16; 3 -7.62,7.62; 4 -7.62,5.08; 5 -7.62,2.54; 6 -7.62,0; 7 -7.62,-2.54; 8 -7.62,-5.08; 9 -7.62,-7.62; 10 -7.62,-10.16; 11 -7.62,-12.7; 12 -7.62,-15.24; 13 7.62,-15.24; 17 7.62,-5.08; 18 7.62,-2.54; 19 7.62,0; 21 7.62,5.08; 22 7.62,7.62; 23 7.62,10.16; 24 7.62,12.7; P$1 7.62,2.54; P$2 7.62,-7.62; P$3 7.62,-10.16; P$4 7.62,-12.7
PS = smd 4 x 4: P$1 -3,6; P$2 3,6; P$3 -3,-7; P$4 3,-7

### Placement (x,y rotation side)
IC1  55.42,35.04 0 top
IC2  53.86,71.12 180 top
IC3  36.16,82.41 180 bottom
IC4  38.12,77.07 180 top
IC5  17.14,82.42 180 bottom
IC6  17.78,77.09 180 top
IC7  38.09,69.12 180 bottom
IC8  36.85,65.26 180 top
IC9  19.04,69.12 180 bottom
IC10  16.51,66.04 180 top
IC11  29.75,16.36 0 bottom
IC12  26.92,21.72 0 top
IC13  45.36,9.15 270 top
IC14  27.86,31.58 0 bottom
IC15  28.15,35.36 0 top
IC16  52.91,24.58 0 bottom
IC17  41.95,34.98 0 top
IC18  92.25,35.02 180 bottom
IC19  52.83,21.75 0 top
IC20  57.02,84.02 180 top
IC21  98.12,62.04 0 top
J1  39.37,49.53 180 top
J2  84.39,50.82 180 bottom
MCU1  115.14,76.78 0 top
U$1  101.57,9.63 90 top

### Tracks (layer width: path | path; a pad name or v marks a point on that pad's centre or on a via)
5V  (via drill 0.6)
  Top 0.61: v27,71 22.23,71 IC6.16 | IC20.6 55.12,84 61.47,84 IC20.16 61.47,75.47 59,73 v46,73 42.56,73 IC4.16 | IC12.16 22.48,22 v35,22 | IC13.16 47,13.6 46.31,14.29 46.31,16.54 45.54,17.31 44.69,17.31 v38,24 36,26 36,27.15 35.69,27.46 35.69,28.54 36,28.85 v36,32 | IC19.16 v48.39,32 48.39,38.86 45.89,41.35 45.89,44.11 v44,46 | v94,44.27 97.09,44.27 | 97.09,44.27 J2.P$12 | 97.09,44.27 102.28,44.27 102.54,44.53 104.53,44.53 v106,46 | IC21.16 93.67,71 v94,71 94,81 102,81 105.78,84.78 105.78,90.2 106.8,91.22 108.24,91.22 109.85,89.62 109.85,82 v117,82 116,82 v116,46
  Bottom 0.61: IC5.16 11,77.92 11,71 | 11,71 v27,71 | v27,71 31.72,75.72 IC3.16 | v27,71 45,71 | 45,71 46,72 v46,73 | v35,22 34.2,22 IC11.16 | 35,22.1 v35,22 | IC18.6 94,37.82 v94,44.27 94,44.47 | v48.39,32 v36,32 | v35,22 36,22 v38,24 | 11,71 9,71 9,48 11,46 v44,46 | IC18.16 87.97,32.05 87.97,26.18 89.46,24.69 102.33,24.69 105.31,27.67 105.31,45.31 v106,46 v116,46 | 45,71 v94,71 | MCU1.21 117,81.86 v117,82
12V  (via drill 0.6)
  Top 0.61: v29,77 v45,77 48.78,77 IC2.9 | v75,27 75,7 | 75,7 v52,7 | v18,4 18,12.15 18.31,12.46 18.31,22.31 v19,23 | v95,47 94.55,47 J2.P$11 | 75,7 95.57,7 U$1.P$1 U$1.P$2 96,13.06 v96,20 | v71,74 72,75 72,93 v96,93 | v111.52,90 v117,90
  Bottom 0.61: IC9.9 24.12,77 v29,77 | IC7.9 43.17,75.17 v45,77 48,74 v71,74 | v75,27 76.89,28.89 76.89,42.46 78.12,43.69 82.54,43.69 85.85,47 v95,47 | IC16.9 47.83,11.17 v52,7 52,4.85 52.31,4.54 52.31,3.46 51.54,2.69 41.74,2.69 40.43,4 v18,4 | IC14.9 19,26.68 v19,23 | v96,93 111.52,93 v111.52,90 | v117,90 122.76,90 MCU1.24 arc-90 123.28,90 131,90 131,49.79 102.79,23.58 99.58,23.58 v96,20
A  (via drill 0.6)
  Top 0.61: IC6.1 22.23,80.22 v26,84 | IC4.1 42.56,91 v32,91 v26,91 v13,91 12,91 | 86.55,79.38 v86.61,79.38 | 12,91 5,91 5,38 13,38 v13,17 | IC12.1 22.48,17 v22,17 | v38,14 38.41,13.6 IC13.1 | v86.61,79.38 86.93,79.06 J2.P$21 | v76,83 78.15,83 80.46,80.69 85.3,80.69 v86.61,79.38 | v47,84 45.89,85.11 45.89,92.38 42.85,95.42 14.57,95.42 12.69,93.54 12.69,91.69 12,91
  Bottom 0.61: IC5.1 12.7,90.7 arc-90 v13,91 | IC3.1 31.72,88.43 31.69,88.46 31.69,90.69 v32,91 | v26,84 v26,91 | v86.61,79.38 86.61,79.32 MCU1.5 | v22,17 v13,17 13,7 34.2,7 | IC11.1 34.2,7 | 34.2,7 38,10.8 v38,14 | v76,83 50,83 49,84 v47,84
B  (via drill 0.6)
  Top 0.61: IC6.2 20.95,84 v24,84 | IC4.2 41.29,89 v33,89 v24,89 v14.25,89 7,89 7,40 15,40 v15,15 | 89.09,76.83 v89.03,76.83 89.47,76.39 J2.P$22 | IC12.2 23.75,15 v23,15 | v29,9 29.69,9.69 29.69,11.54 30.48,12.32 IC13.2 | v85,78 83.42,79.58 80,79.58 78.58,81 v76,81 | v45.47,82.42 44.78,83.11 44.78,91.92 42.39,94.31 15.31,94.31 v14,93
  Bottom 0.61: IC3.2 32.99,86.32 32.98,86.33 32.98,88.98 v33,89 | v24,84 v24,89 | MCU1.6 89.03,76.78 v89.03,76.83 87.86,78 v85,78 | v23,15 v15,15 15,9 v29,9 32.92,9 IC11.2 | 13.97,89 IC5.2 | 13.97,89 v14.25,89 | v76,81 75.11,81.89 49,81.89 48.34,82.42 v45.47,82.42 | 13.97,89 13.97,89.45 14.31,89.79 14.31,91.91 14,92.22 v14,93
C  (via drill 0.6)
  Top 0.61: 19.68,86.87 v15.49,86.87 9,86.87 9,42 17,42 v17,13 | 19.68,86.87 v34.29,86.87 40.02,86.87 IC4.3 | IC6.3 19.68,86.87 | 91.63,74.3 v91.69,74.3 92.01,73.98 J2.P$23 | IC12.3 25.02,13 v23,13 | v31,11 31.05,11.05 IC13.3 | v85,75 81.53,78.47 79.54,78.47 79.01,79 v76,79 | v44,81 43.67,81.33 43.67,91.46 42.13,93 v16,93
  Bottom 0.61: v34.29,86.87 34.26,86.87 IC3.3 | MCU1.7 91.69,74.24 v91.69,74.3 90.99,75 v85,75 | v23,13 v17,13 17,11 v31,11 31.66,11 IC11.3 | IC5.3 15.24,86.87 v15.49,86.87 15.49,88.39 15.56,88.46 15.56,92.56 v16,93 | v76,79 74.22,80.78 48.54,80.78 48.32,81 v44,81
C1  (via drill 0.6)
  Top 0.61: J1.P$29 42,52.07 v42,57 41.3,57 IC8.16
  Bottom 0.61: v42,57 40.63,58.37 IC7.12
C2  (via drill 0.6)
  Top 0.61: J1.P$9 41,48.62 v41,43 40.05,42.05 IC17.14
  Bottom 0.61: v41,43 52.15,43 57.99,37.16 IC16.18
C3  (via drill 0.6)
  Top 0.61: J1.P$30 40,52.07 v40,56 40.02,56 IC8.15
  Bottom 0.61: v40,56 39.36,56 IC7.13
C4  (via drill 0.6)
  Top 0.61: J1.P$10 39,49.16 v39,43 38.77,42.77 IC17.15
  Bottom 0.61: v39,43 39.15,43 40.46,41.69 51.31,41.69 56.88,36.12 56.88,30.86 56.85,30.83 56.85,29.62 IC16.17
C5  (via drill 0.6)
  Top 0.61: J1.P$31 37.81,53.05 37.81,53.16 38,53.35 v38,57 38.76,57 IC8.14
  Bottom 0.61: v38,57 38.09,57 IC7.14
C6  (via drill 0.6)
  Top 0.61: J1.P$11 37,49.36 v37,43 37.51,42.49 IC17.16
  Bottom 0.61: v37,43 37.15,43 39.57,40.58 50.42,40.58 55.45,35.55 IC16.16
C7  (via drill 0.6)
  Top 0.61: J1.P$32 35.27,53.05 35.27,53.16 36,53.89 v36,56 36.69,56.69 36.69,57.54 37.48,58.34 IC8.13
  Bottom 0.61: IC7.15 36.82,57.67 36.69,57.54 36.69,56.69 v36,56
C8  (via drill 0.6)
  Top 0.61: J1.P$12 33.31,48.55 33.31,43.46 32,42.15 v32,41 31.32,40.33 IC15.10
  Bottom 0.61: v32,41 32.94,40.06 IC14.18
C9  (via drill 0.6)
  Top 0.61: J1.P$33 32.73,53.05 32.73,54.58 35,56.85 v35,58 36.22,59.22 IC8.12
  Bottom 0.61: v35,58 35.55,58 IC7.16
C10  (via drill 0.6)
  Top 0.61: J1.P$13 31.75,43.75 v31,43 30.11,42.11 30.11,38.16 IC15.11
  Bottom 0.61: IC14.17 31.67,39.48 30.69,40.46 30.69,41.54 31,41.85 v31,43
C11  (via drill 0.6)
  Top 0.61: J1.P$34 30.19,53.05 30.19,53.61 33,56.42 v33,58 34.95,59.95 IC8.11
  Bottom 0.61: v33,58 34.28,59.28 IC7.17
C12  (via drill 0.6)
  Top 0.61: J1.P$14 29.21,44.21 v29,44 29,39.14 28.95,39.09 28.95,38.33 IC15.12
  Bottom 0.61: IC14.16 30.4,39.18 29.58,40 29.58,43.42 v29,44
C13  (via drill 0.6)
  Top 0.61: J1.P$35 27.65,53.05 27.65,53.16 31,56.51 v31,58 33.67,60.67 IC8.10
  Bottom 0.61: v31,58 33.01,60.01 IC7.18
C14  (via drill 0.6)
  Top 0.61: J1.P$15 26.67,44.33 v27,44 27,42.14 27.36,41.78 27.36,38.32 IC15.13
  Bottom 0.61: v27,44 28.47,42.53 28.47,39.54 29.13,38.88 IC14.15
C15  (via drill 0.6)
  Top 0.61: J1.P$36 v24.13,57.91 24.13,60.06 IC10.16
  Bottom 0.61: v24.13,57.91 22.9,59.14 22.9,59.47 21.58,60.79 IC9.12
C16  (via drill 0.6)
  Top 0.61: J1.P$16 24.13,43.87 v25,43 25,42.57 26.09,41.48 26.09,38.32 IC15.14
  Bottom 0.61: v25,43 27.36,40.64 27.36,39.08 27.86,38.58 IC14.14
C17  (via drill 0.6)
  Top 0.61: J1.P$37 v21.59,58.93 21.59,59.41 19.68,61.31 IC10.15
  Bottom 0.61: v21.59,58.93 20.31,60.21 IC9.13
C18  (via drill 0.6)
  Top 0.61: J1.P$17 21.59,44.41 v23,43 24.98,41.02 IC15.15
  Bottom 0.61: v23,43 26.25,39.75 26.25,38.62 26.59,38.28 IC14.13
C19  (via drill 0.6)
  Top 0.61: J1.P$38 18.41,52.7 v18.41,58.8 IC10.14
  Bottom 0.61: v18.41,58.8 19.04,59.43 IC9.14
C20  (via drill 0.6)
  Top 0.61: J1.P$18 20.03,48.55 20.03,44.12 22,42.15 v22,41 23.7,39.3 IC15.16
  Bottom 0.61: v22,41 24.7,38.3 24.71,38.3 25.32,37.7 IC14.12
C21  (via drill 0.6)
  Top 0.61: J1.P$39 16,52.58 v16,56 17.11,57.11 17.11,59.34 17.14,59.38 IC10.13
  Bottom 0.61: IC9.15 17.77,60.01 17.11,59.34 17.11,57.11 v16,56
C22  (via drill 0.6)
  Top 0.61: J1.P$19 15.53,48.55 15.53,48.44 15.06,47.97 12.88,47.97 11.3,49.55 11.3,60 v12,60 13.34,60 IC10.10
  Bottom 0.61: v12,60 13.96,61.96 IC9.18
C23  (via drill 0.6)
  Top 0.61: J1.P$40 14,52.1 v14,55 14.69,55.69 14.69,56.54 15.88,57.73 IC10.12
  Bottom 0.61: v14,55 14.69,55.69 14.69,58.5 16.5,60.3 IC9.16
C24  (via drill 0.6)
  Top 0.61: J1.P$20 12.99,50.51 12.88,50.51 12.41,50.98 12.41,55.26 13,55.85 v13,58 14.61,59.6 IC10.11
  Bottom 0.61: IC9.17 15.23,60.6 13.58,58.96 13.58,58.58 v13,58
E1  (via drill 0.6)
  Top 0.61: v81,85 101,85 101,94 121,94 121,35 93,35 93,29 v90,26
  Bottom 0.61: IC3.6 38.23,85.37 38.23,88.19 40.35,90.31 49.54,90.31 50.31,89.54 50.31,85.69 51,85 v81,85 | IC18.14 90.34,30.2 89.69,29.54 89.69,28.46 90,28.15 v90,26
E2  (via drill 0.6)
  Top 0.61: IC4.6 36.37,79.71 36.37,78.94 36.85,78.47 43.19,78.47 43.73,79 v48,79 | v91,29 91,37 119,37 119,92.75 103,92.75 102.11,91.86 102.11,84.54 100.57,83 v81,83
  Bottom 0.61: v91,29 91.61,29 IC18.13 | v48,79 51,76 81,76 v81,83
E3
  Bottom 0.6: 102.62,72.88 102.62,34 | 26.88,92.38 42,92.38 42.5,92.38 | IC18.12 92.88,32.12
  Bottom 0.61: IC5.6 19.05,85.99 25.43,92.38 26.88,92.38 | 102.62,34 102.61,33.98 102.61,26.54 101.96,25.89 94.54,25.89 92.96,27.47 92.96,32.15 IC18.12 | 42,92.38 51.62,92.38 51.62,88 83,88 83,73 91.14,73 91.15,72.99 102.51,72.99 102.62,72.88
E4  (via drill 0.6)
  Top 0.6: v30.5,69.5 22,78 15.88,78
  Top 0.61: IC6.6 15.88,78
  Bottom 0.6: 101.5,34.5 101.5,69.5 v30.5,69.5
  Bottom 0.61: 101.5,34.5 101.5,27 95,27 94.07,27.93 94.07,29.37 94.16,29.46 IC18.11
E5  (via drill 0.6)
  Top 0.6: v76.5,10 95,28.5 v95.38,28.83
  Bottom 0.6: v76.5,10 76.5,1.5 16.5,1.5 11.5,6.5 11.5,18.5 22.5,18.5 24,17 24,16 27.84,16 28,16
  Bottom 0.61: IC11.6 27.84,16 27.95,16.11 | IC18.10 95.42,28.83 v95.38,28.83
E6  (via drill 0.6)
  Top 0.61: IC12.6 28.83,20.89 22.02,20.89 21.91,21 20,21 20,2 82,2 v82,4 | v82,10 97.03,25.03 v97.03,28.83
  Bottom 0.61: IC18.9 96.69,28.83 v97.03,28.83 | v82,4 v82,10
E7  (via drill 0.6)
  Top 0.61: v45,16 45,7.25 IC13.6
  Bottom 0.61: v45,16 44.49,16 44.49,24 78,24 78,42 82.42,42 86,45.58 95.42,45.58 IC18.7
EA  (via drill 0.6)
  Top 0.61: J2.P$8 87,49.55 v87,40 88,39 114,39 v114,72
  Bottom 0.61: v87,40 87.81,39.2 IC18.1 | v114,72 113.7,71.7 MCU1.8
EB  (via drill 0.6)
  Top 0.61: J2.P$9 arc90 89,49.08 v89,41 90,42 92.85,42 93.04,41.82 102.97,41.82 103.46,42.31 104.54,42.31 105.85,41 112,41 v112,69
  Bottom 0.61: IC18.2 89.08,40 v89,41 | v112,69 107.52,69 MCU1.9
EC  (via drill 0.6)
  Top 0.61: v110,66 110,46 107.42,43.42 103,43.42 102.55,42.97 99.02,42.97 | J2.P$10 v92.01,44 v92,44 92.42,44 93.46,42.97 99.02,42.97 | 99.06,42.93 99.02,42.97
  Bottom 0.61: IC18.3 90.34,41.34 91,42 92,42 v92,44 | v110,66 109.38,66.62 MCU1.10
EE1  (via drill 0.6)
  Top 0.61: v92,40.62 104,40.62 v104,41 | v104,71 102,71 v99,68 | v97,57 97.48,57.48 IC21.4
  Bottom 0.61: IC18.5 92.72,37.98 92.72,38.75 92,39.47 v92,40.62 | v99,68 99,59 v97,57 | v104,41 v104,71
EE2
  Top 0.61: IC21.5 98.75,55 94.55,55 J2.P$24
EE3
  Top 0.61: IC21.6 100.03,53.89 97.09,53.89 J2.P$25
EE4
  Top 0.61: J2.P$26 101.3,52.09 IC21.7
GND  (via drill 0.6)
  Top 0.61: IC19.8 57.28,20.94 59.7,23.37 59.7,29 | IC1.8 59.7,32.08 59.7,29 | IC10.8 11,68.84 v11,82 13.34,82 | 13.34,82 IC6.8 | 13.34,82 17.14,82 IC6.5 IC6.4 | IC4.8 33.67,82 | 33.67,82 37.48,82 IC4.5 IC4.4 | v49,89 52.58,89 | 52.58,89 IC20.8 | 52.58,89 56.39,89 IC20.5 | v46,66 46.22,66.22 IC2.10 | v28,68 28.06,68.06 IC8.8 32.41,70.59 27,76 v27,82 33.67,82 | v36,15 36,17 | 36,17 31.37,17 | 31.37,17 IC12.8 | 31.37,17 27.56,17 | 27.56,17 IC12.5 IC12.4 | 27.56,17 27,17 27,6 38.15,6 | 38.15,6 39.46,4.69 41.92,4.69 41.93,4.71 IC13.8 | 38.15,6 38,6.15 38,8 38.52,8.52 IC13.5 IC13.4 | IC15.8 32.59,30 v34,30 34,25 37,22 37,17 36,17 | IC17.8 46.4,30 46,30 | 46,30 v44,30 | v99.57,47.12 99.57,49.49 arc-90 J2.P$13 100.61,50.53 101.31,50.53 102.41,51.63 102.41,53 | IC21.8 102.41,59.08 102.41,53 | IC21.1 93.83,59.4 93.83,61.76 95.3,63.22 105,63.22 105.78,63.99 105.78,81.22 v105,82 | IC19.5 IC19.4 52.2,21 46,21 46,30 | 59.7,29 v62,29 | v70,29 80,29 v80,35 | U$1.P$3 99,6.63 v99,31 | v117,85 v111.52,85 | v107,53 102.41,53
  Bottom 0.61: 16.51,82 v11,82 11,79.49 7.89,76.38 7.89,47.54 10.54,44.89 19,44.89 19,38 22.78,38 IC14.10 22.78,30 v34,30 v44,30 45,30 | 16.51,82 IC5.4 IC5.5 | 16.51,82 21.59,82 | 21.59,82 IC5.8 | 21.59,82 v27,82 35.53,82 | 35.53,82 IC3.4 IC3.5 | 35.53,82 40.61,82 IC3.8 40.61,89 v49,89 | IC9.10 27.9,68 v28,68 43,68 43.17,67.83 | 43.17,67.83 IC7.10 | 43.17,67.83 45,66 v46,66 | IC11.8 25.3,12.11 29,12.11 arc90 29.11,12.22 IC11.5 IC11.4 30.39,15 v36,15 | 45,30 47.83,30 IC16.10 | 91.61,35 IC18.4 | 96.69,35 IC18.8 96.69,47.12 v99.57,47.12 | 91.61,35 96.69,35 | v105,82 107.52,82 MCU1.4 107.52,84 MCU1.3 107.52,85 v111.52,85 | v70,29 v62,29 59,26 45,26 45,30 | v80,35 91.61,35 | v99,31 99,32.7 96.69,35 | v117,85 117,86.94 MCU1.23 129,86.94 129,53 v107,53
N$1  (via drill 0.6)
  Top 0.61: IC21.2 95.11,59.4 95.11,61.46 95.75,62.11 104.46,62.11 105.28,61.28 | 105.28,61.28 105.31,61.26 | 105.28,61.28 105.28,59.56 105.31,59.54 105.31,57.69 106,57 v108,57
  Bottom 0.61: MCU1.18 121,72.48 121,58.54 119.46,57 v108,57
N$2  (via drill 0.6)
  Top 0.61: IC21.3 96.22,61 104,61 104,55 v108,55
  Bottom 0.61: MCU1.19 119.89,73.91 119.89,59 106,59 106,55 v108,55
N$15
  Top 0.61: IC1.1 50.93,32.24 IC19.14
N$16
  Top 0.61: IC1.2 52.2,32.24 IC19.13
N$17
  Top 0.61: IC1.3 53.47,32.24 IC19.12
N$18
  Top 0.61: IC1.4 54.74,32.24 IC19.11
N$19
  Top 0.61: IC1.5 56.01,32.24 IC19.10
N$20
  Top 0.61: IC1.6 57.28,32.24 IC19.9
N$21
  Top 0.61: IC1.7 58.44,32.08 58.44,23.67 56.01,21.24 IC19.7
N$24
  Top 0.61: IC2.1 58.93,76.02 IC20.14
N$25
  Top 0.61: IC2.2 57.66,76.02 IC20.13
N$26
  Top 0.61: IC2.3 56.39,76.02 IC20.12
N$27
  Top 0.61: IC2.4 55.12,76.02 IC20.11
N$28
  Top 0.61: IC2.5 53.85,76.02 IC20.10
N$29
  Top 0.61: IC2.6 52.58,76.02 IC20.9
N$30
  Top 0.61: IC2.7 51.45,76.16 51.45,82.14 53.85,84.53 IC20.7
N$63
  Bottom 0.61: IC14.1 32.92,26.66 IC11.15
N$64
  Bottom 0.61: IC14.2 31.66,26.66 IC11.14
N$65
  Bottom 0.61: IC14.3 30.39,26.66 IC11.13
N$66
  Bottom 0.61: IC14.4 29.11,26.66 IC11.12
N$67
  Bottom 0.61: IC14.5 27.84,26.66 IC11.11
N$68
  Bottom 0.61: IC14.6 26.57,26.66 IC11.10
N$69
  Bottom 0.61: IC14.7 25.3,26.66 IC11.9
N$70
  Top 0.61: IC12.15 23.7,24.56 IC15.1
N$71
  Top 0.61: IC12.14 24.98,24.56 IC15.2
N$72
  Top 0.61: IC12.13 26.25,24.56 IC15.3
N$73
  Top 0.61: IC12.12 27.52,24.56 IC15.4
N$74
  Top 0.61: IC12.11 28.79,24.56 IC15.5
N$75
  Top 0.61: IC12.10 30.05,24.56 IC15.6
N$76
  Top 0.61: IC12.9 31.32,24.56 IC15.7
N$77  (via drill 0.6)
  Top 0.61: IC13.15 58,12.32 v58,12.37
  Bottom 0.61: v58,12.37 57.99,13 IC16.1
N$78  (via drill 0.6)
  Top 0.61: IC13.14 56,11.05 v56,11
  Bottom 0.61: IC16.2 56.72,13.57 56.69,13.54 56.69,11.69 v56,11
N$79  (via drill 0.6)
  Top 0.61: IC13.13 54,9.79 v54,9
  Bottom 0.61: IC16.3 55.45,12.3 54.69,11.54 54.69,9.69 v54,9
N$80  (via drill 0.6)
  Top 0.61: IC13.10 50,5.97 v50,6 | v37,28 37.51,28 IC17.1
  Bottom 0.61: v50,6 46,6 43.11,8.89 43.11,26.46 43,26.57 43,28 v37,28
N$81  (via drill 0.6)
  Top 0.61: IC13.9 49.45,4.71 49.46,4.69 50.31,4.69 v51,4 | v39,26 38.77,26 IC17.2
  Bottom 0.61: v39,26 42,26 42,4 v51,4
N$82  (via drill 0.6)
  Top 0.61: v40,24 40,25.15 40.31,25.46 40.31,26.54 40.05,26.8 IC17.3 | v40,6 42.56,6 IC13.7
  Bottom 0.61: v40,24 v40,6
N$83
  Bottom 0.61: IC3.15 33.01,79.61 IC7.1
N$84
  Bottom 0.61: IC3.14 34.28,79.61 IC7.2
N$85
  Bottom 0.61: IC3.13 35.55,79.61 IC7.3
N$86
  Bottom 0.61: IC3.12 36.82,79.61 IC7.4
N$87
  Bottom 0.61: IC3.11 38.09,79.61 IC7.5
N$88
  Bottom 0.61: IC3.10 39.36,79.61 IC7.6
N$89
  Bottom 0.61: IC3.9 40.63,79.61 IC7.7
N$90
  Top 0.61: IC8.1 IC4.15
N$91
  Top 0.61: IC8.2 IC4.14
N$92
  Top 0.61: IC8.3 IC4.13
N$93
  Top 0.61: IC8.4 IC4.12
N$94
  Top 0.61: IC8.5 IC4.11
N$95
  Top 0.61: IC8.6 IC4.10
N$96
  Top 0.61: IC8.7 IC4.9
N$97
  Bottom 0.61: IC9.1 IC5.15
N$98
  Bottom 0.61: IC9.2 IC5.14
N$99
  Bottom 0.61: IC9.3 IC5.13
N$100
  Bottom 0.61: IC9.4 IC5.12
N$101
  Bottom 0.61: IC9.5 IC5.11
N$102
  Bottom 0.61: IC9.6 IC5.10
N$103
  Bottom 0.61: IC9.7 IC5.9
N$104
  Top 0.61: IC10.1 IC6.15
N$105
  Top 0.61: IC10.2 IC6.14
N$106
  Top 0.61: IC10.3 IC6.13
N$107
  Top 0.61: IC10.4 IC6.12
N$108
  Top 0.61: IC10.5 IC6.11
N$109
  Top 0.61: IC10.6 IC6.10
N$110
  Top 0.61: IC10.7 IC6.9
R1H  (via drill 0.6)
  Top 0.61: J1.P$27 v47,55 47,57 51.32,61.32 IC2.12 | v84,55 84.39,54.61 J2.P$20
  Bottom 0.61: v84,55 81.85,55 80.99,54.14 49.01,54.14 48.15,55 v47,55
R1L  (via drill 0.6)
  Top 0.61: J1.P$7 v47,47 47,41.81 IC1.16 | v84,47 84.39,47.39 J2.P$7
  Bottom 0.61: v84,47 81.85,47 80.99,47.86 49.01,47.86 48.15,47 v47,47
R2H  (via drill 0.6)
  Top 0.61: J1.P$26 49.53,55.47 v49,56 52.59,59.59 IC2.13 | v81,56 81.85,55.15 J2.P$19
  Bottom 0.61: v81,56 79.85,56 79.1,55.25 51.9,55.25 51.15,56 v49,56
R2L  (via drill 0.6)
  Top 0.61: J1.P$6 49.53,46 v49,46 49,41.85 52.09,38.77 52.09,38 IC1.15 | v81,46 81.85,46.85 J2.P$6
  Bottom 0.61: v81,46 79.85,46 79.1,46.75 50.9,46.75 50.15,46 v49,46
R3H  (via drill 0.6)
  Top 0.61: J1.P$25 52.07,56.93 v52,57 53.86,58.86 IC2.14 | v79,57 79.31,56.69 J2.P$18
  Bottom 0.61: v79,57 76.85,57 76.21,56.36 54.79,56.36 54.15,57 v52,57
R3L  (via drill 0.6)
  Top 0.61: J1.P$5 52.07,46.07 v51,45 51,41.42 53.35,39.07 53.35,38 IC1.14 | v79,45 79.31,45.31 J2.P$5
  Bottom 0.61: v79,45 75.85,45 75.21,45.64 52.79,45.64 52.15,45 v51,45
R4H  (via drill 0.6)
  Top 0.61: J1.P$24 54.61,58 v55,58 55,66.22 IC2.15 | v76,58 76.77,57.23 J2.P$17
  Bottom 0.61: v76,58 74.85,58 74.32,57.47 56.68,57.47 56.15,58 v55,58
R4L  (via drill 0.6)
  Top 0.61: J1.P$4 53.63,48.55 53.63,46.06 53,45.43 v53,44 53,40.99 54.62,39.37 54.62,38 IC1.13 | v75,44 76.77,45.77 J2.P$4
  Bottom 0.61: v75,44 73.85,44 73.32,44.53 54.68,44.53 54.15,44 v53,44
R5H  (via drill 0.6)
  Top 0.61: J1.P$23 57.15,59 v57,59 56.4,59 IC2.16 | v74,59 74.23,58.77 J2.P$16
  Bottom 0.61: v74,59 71.85,59 71.43,58.58 58.57,58.58 58.15,59 v57,59
R5L  (via drill 0.6)
  Top 0.61: J1.P$3 56.17,48.55 56.17,48.44 55,47.27 v55,43 55,40.56 55.9,39.67 55.9,38 IC1.12 | v73,43 73.69,43.69 73.69,44.54 74.23,45.08 J2.P$3
  Bottom 0.61: v73,43 71.85,43 71.43,43.42 56.57,43.42 56.15,43 v55,43
R6H  (via drill 0.6)
  Top 0.61: J1.P$22 59,52.07 v59,60 57.67,61.33 IC2.17 | v71,60 71.69,59.31 J2.P$15
  Bottom 0.61: v71,60 69.85,60 69.54,59.69 61.46,59.69 61.15,60 v59,60
R6L  (via drill 0.6)
  Top 0.61: J1.P$2 58.71,48.55 58.71,48.44 57,46.73 v57,42 57.33,42 IC1.11 | v71,42 71.69,42.69 J2.P$2
  Bottom 0.61: v71,42 69.85,42 69.54,42.31 58.46,42.31 58.15,42 v57,42
R7H  (via drill 0.6)
  Top 0.61: J1.P$21 62,52.07 v62,61 58.94,64.06 IC2.18 | v69,61 69.15,60.85 J2.P$14
  Bottom 0.61: v69,61 v62,61
R7L  (via drill 0.6)
  Top 0.61: J1.P$1 61.25,48.55 61.25,48.44 59,46.19 v59,41 58.59,41 IC1.10 | v69,41 69.15,41.15 J2.P$1
  Bottom 0.61: v69,41 v59,41
RA  (via drill 0.6)
  Top 0.61: IC19.1 48.39,17.58 51.97,14 60,14 60.67,14.67 61.38,14.67 67.33,20.62 67.33,52 67.59,52.26 67.59,61.44 68,61.85 v68,95 | v61.47,95.38 IC20.1
  Bottom 0.61: v61.47,95.38 67.62,95.38 v68,95 113,95 113,74 114.43,74 114.54,73.89 115.31,73.35 115.31,69.46 110.54,64.69 108.13,64.69 MCU1.11
RB  (via drill 0.6)
  Top 0.61: IC19.2 49.66,17.88 52.21,15.32 58.83,15.32 59.28,15.78 60.92,15.78 66.22,21.08 66.22,88.8 66.42,89 66.42,92.58 66.42,92.59 v66.42,93.98 | IC20.2 60.2,91.35 60.31,91.46 60.31,93.69 v60,94
  Bottom 0.61: v66.42,93.98 66.4,94 v60,94 60.16,94.16 60.16,95.92 60.93,96.69 115,96.69 115,75 116.42,74 116.42,69 111,63.58 109.56,63.58 MCU1.12
RC  (via drill 0.6)
  Top 0.61: IC19.3 50.93,18.18 52.67,16.43 58.37,16.43 58.83,16.89 60.46,16.89 65.11,21.54 65.11,89.26 65.31,89.46 65.31,90.54 65,90.85 v65,92 | 58.93,92 v59,92 | 58.93,92 IC20.3 | v127,70 126.31,70.69 126.31,91.83 121.45,96.69 61,96.69 | 61,96.69 60.84,96.69 | 61,96.69 58,96.69 58,92 58.93,92
  Bottom 0.61: v65,92 v59,92 | MCU1.13 127,65.78 v127,70
RE  (via drill 0.6)
  Top 0.61: IC19.6 54.9,18.79 54.9,18.02 55.37,17.54 57.91,17.54 58.37,18 60,18 64,22 v64,90 | v57.38,90 57.66,90 IC20.4 | v98,90 99.89,91.89 99.89,94.46 100.54,95.11 121.46,95.11 125,91.57 v125,73
  Bottom 0.61: v57.38,90 v64,90 v98,90 | v125,73 123.7,71.7 MCU1.17